# EAGLE board VMEMega (EAGLE 6.5.0), part 1 of 2
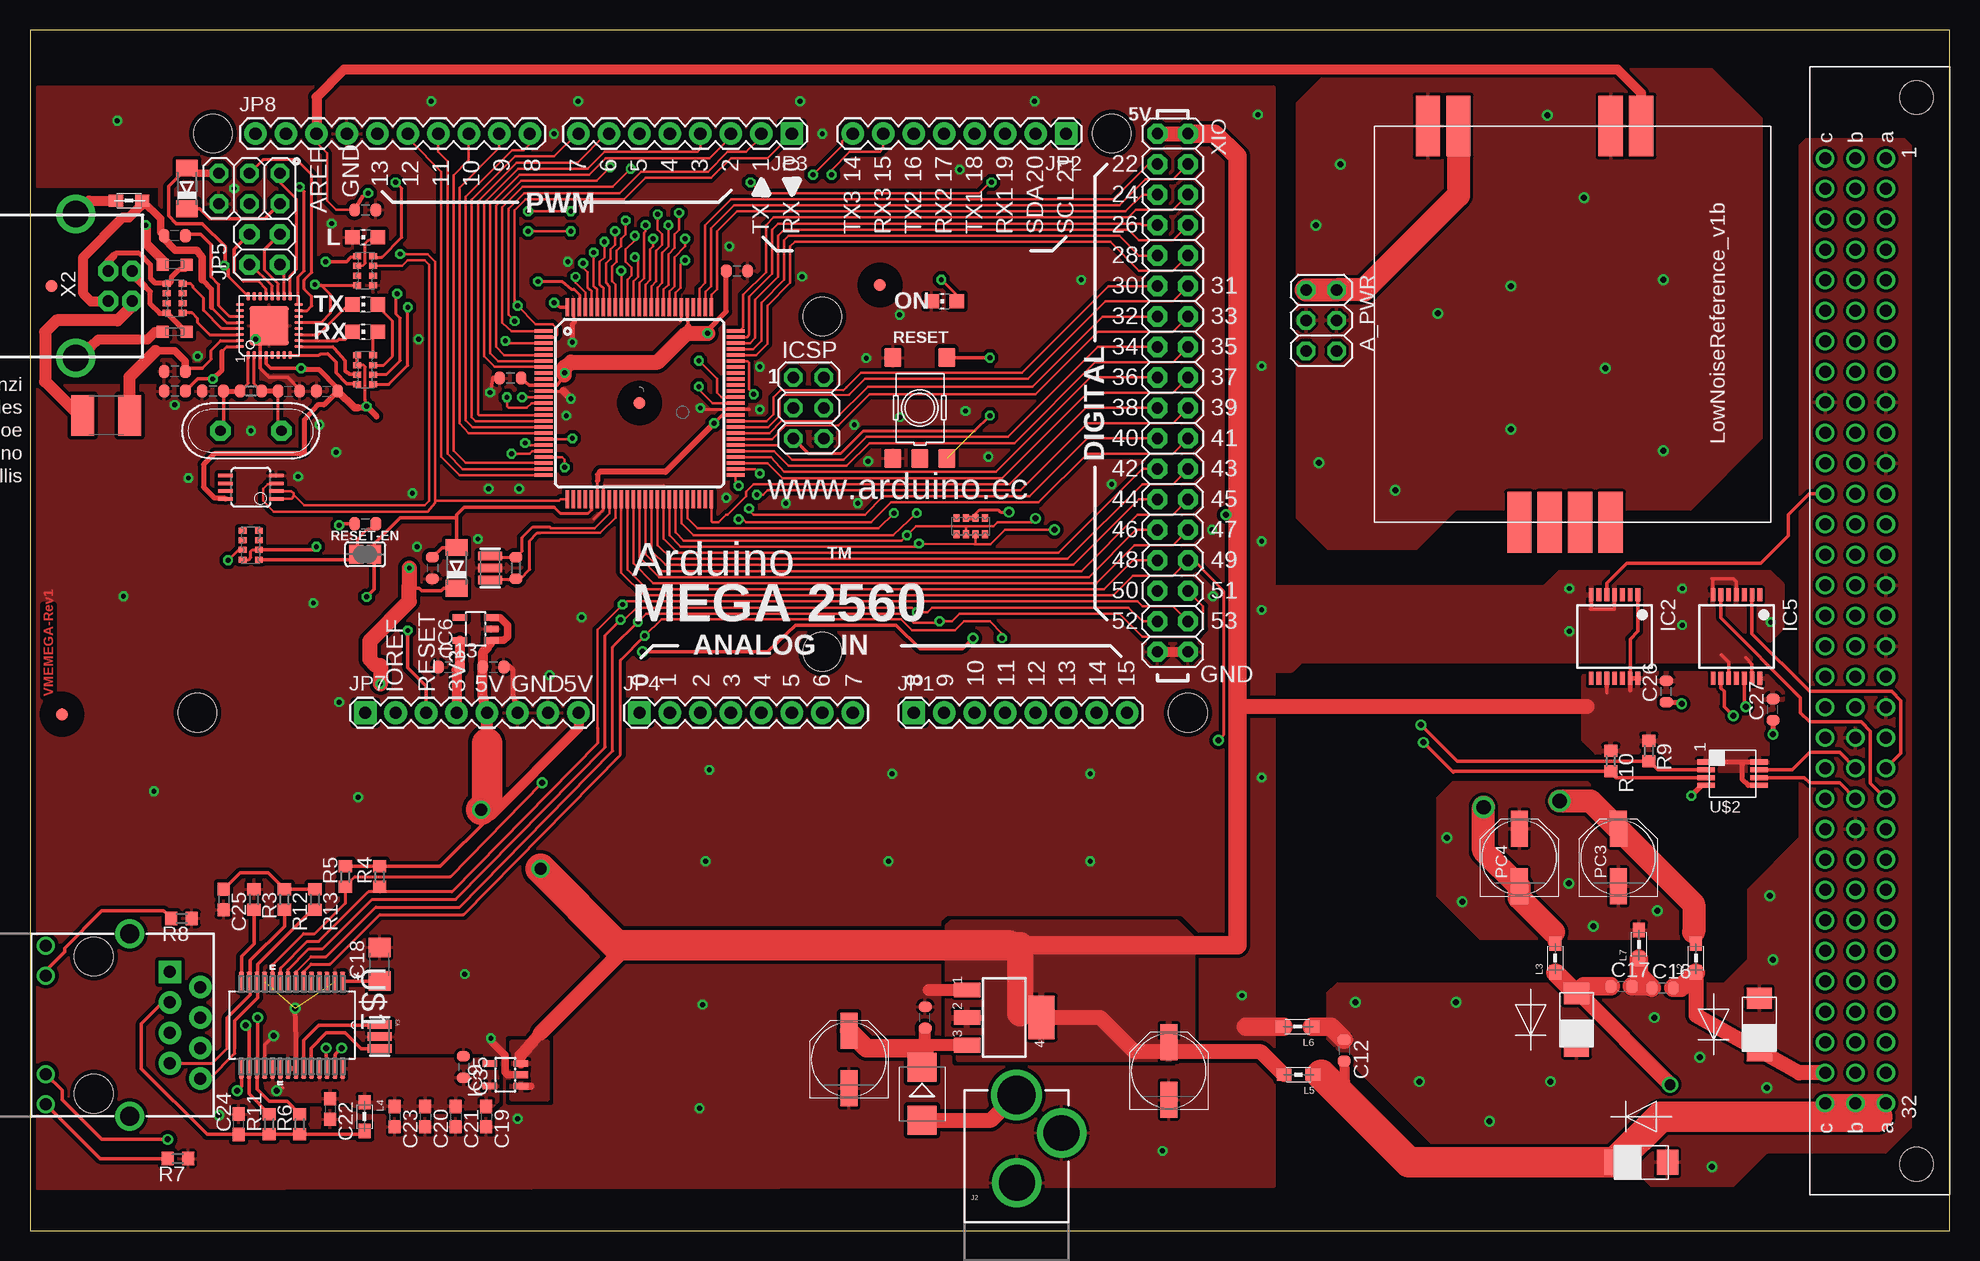
[diagram p5: board, top side]
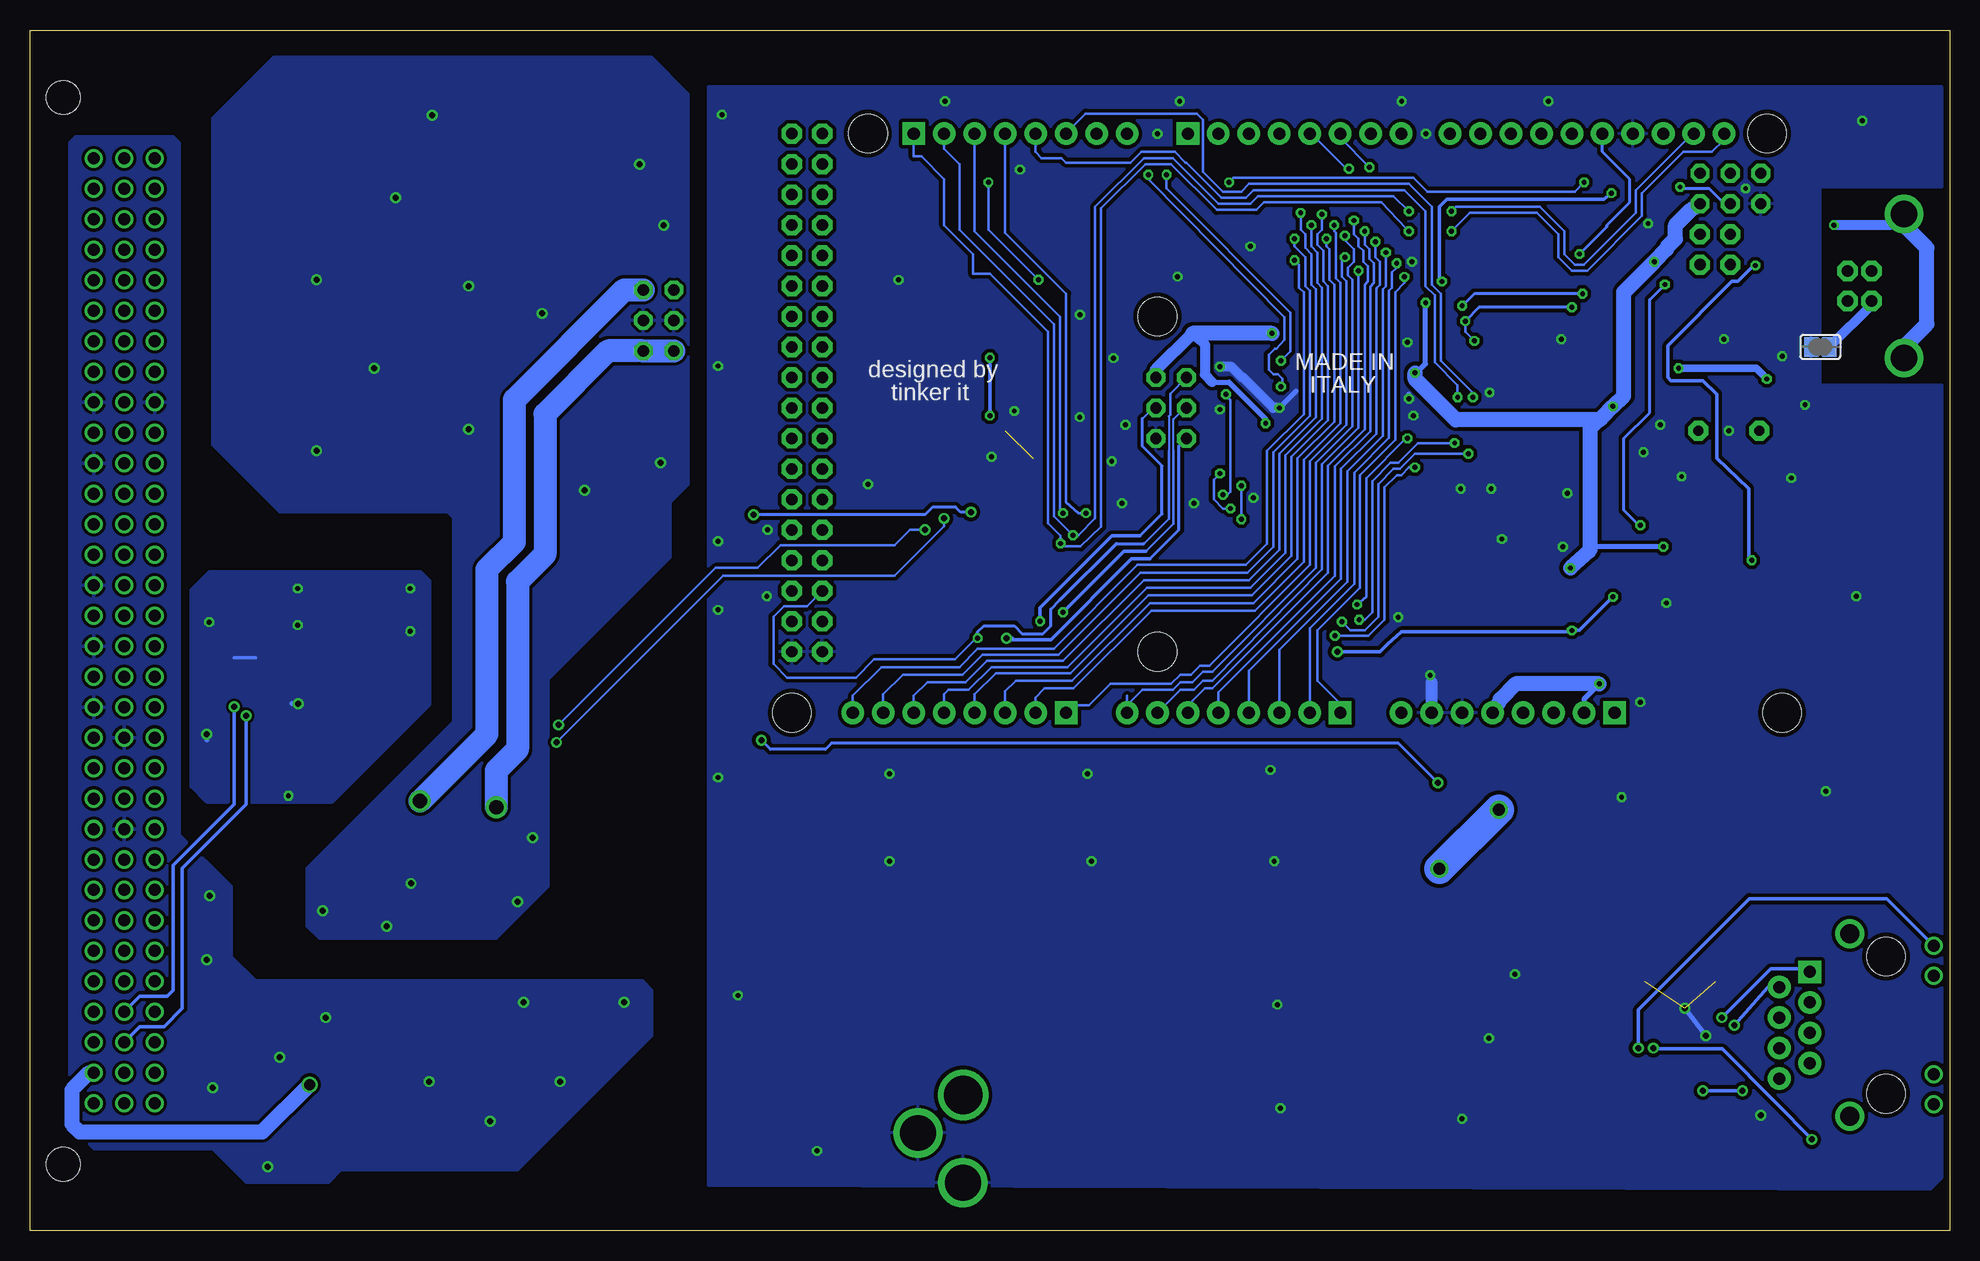
[diagram p6: board, bottom side, seen from below]

Size 160.02 x 100.08 mm. Coordinates in mm from the lower left corner, seen from the top.
Outline: 0,0 160.02,0 160.02,100.08 0,100.08 0,0
Copper layers (1*16): Top 0.035559375mm / dielectric 1.501140625mm / Bottom 0.035559375mm
Design rules "elecrow": minimum track width 8mil, minimum drill 12mil, track to track 6mil, track to pad 6mil, pad to pad 8mil, via to via 6mil, smd to smd 6mil, copper to edge 15mil, drill to drill 8mil, minimum pad ring 10mil, minimum via ring 8mil, stop-mask expansion 4mil, vias tented up to drill 20mil, thermal gap 10mil
Net classes: 0 default: width 0.203 mm, drill 0.406 mm, clearance 0.203 mm; 1 power: width 0.254 mm, drill 0.305 mm, clearance 0.203 mm; 2 gnd: width 0.254 mm, drill 0.406 mm, clearance 0.203 mm; 3 power usb: width 0.254 mm, drill 0.305 mm, clearance 0.203 mm; 4 aref: width 0.406 mm, drill 0.61 mm, clearance 0.254 mm
Holes 3.2 mm at 96.52,43.18 15.24,91.44 90.17,91.44 13.97,43.18 66.04,76.2 66.04,48.26

## Footprints (pad centres in the part's own frame; a part is rotated, then mirrored left to right if it is on the bottom)
2X03 = drill 0.95 pad 1.55 octagon: 1 -2.54,-1.27; 2 -2.54,1.27; 3 0,-1.27; 4 0,1.27; 5 2.54,-1.27; 6 2.54,1.27
C0603-ROUND = smd 0.898 x 1.1: 1 -0.889,0; 2 0.889,0
C1206 = smd 1.6 x 1.8: 1 -1.4,0; 2 1.4,0
C0603 = smd 1.1 x 1: 1 -0.85,0; 2 0.85,0
SMB = smd 2.4 x 2.4: A 2.2,0; C -2.2,0
MINIMELF = smd 1.4 x 1.8: A 1.7,0; C -1.7,0
L1812 = smd 1.9 x 3.4: 1 -1.95,0; 2 1.95,0
FIDUCIA-MOUNT = smd 1.016 x 1.016: P$1 0,0
SJ = smd 1.168 x 1.6: 1 -0.762,0; 2 0.762,0
SOT223 = smd 1.219 x 2.235: 1 -2.311,-3.099; 2 0,-3.099; 3 2.311,-3.099 | smd 3.6 x 2.2: 4 0,3.099
SSOP14 = smd 0.4 x 1.1: 1 -1.95,-3.475; 2 -1.3,-3.475; 3 -0.65,-3.475; 4 0,-3.475; 5 0.65,-3.475; 6 1.3,-3.475; 7 1.95,-3.475; 8 1.95,3.475; 9 1.3,3.475; 10 0.65,3.475; 11 0,3.475; 12 -0.65,3.475; 13 -1.3,3.475; 14 -1.95,3.475
TQFP100 = smd 1.5 x 0.28: 1 -8,6; 2 -8,5.5; 3 -8,5; 4 -8,4.5; 5 -8,4; 6 -8,3.5; 7 -8,3; 8 -8,2.5; 9 -8,2; 10 -8,1.5; 11 -8,1; 12 -8,0.5; 13 -8,0; 14 -8,-0.5; 15 -8,-1; 16 -8,-1.5; 17 -8,-2; 18 -8,-2.5; 19 -8,-3; 20 -8,-3.5; 21 -8,-4; 22 -8,-4.5; 23 -8,-5; 24 -8,-5.5; 25 -8,-6; 51 8,-6; 52 8,-5.5; 53 8,-5; 54 8,-4.5; 55 8,-4; 56 8,-3.5; 57 8,-3; 58 8,-2.5; 59 8,-2; 60 8,-1.5; 61 8,-1; 62 8,-0.5; 63 8,0; 64 8,0.5; 65 8,1; 66 8,1.5; 67 8,2; 68 8,2.5; 69 8,3; 70 8,3.5; 71 8,4; 72 8,4.5; 73 8,5; 74 8,5.5; 75 8,6 | smd 0.28 x 1.5: 26 -6,-8; 27 -5.5,-8; 28 -5,-8; 29 -4.5,-8; 30 -4,-8; 31 -3.5,-8; 32 -3,-8; 33 -2.5,-8; 34 -2,-8; 35 -1.5,-8; 36 -1,-8; 37 -0.5,-8; 38 0,-8; 39 0.5,-8; 40 1,-8; 41 1.5,-8; 42 2,-8; 43 2.5,-8; 44 3,-8; 45 3.5,-8; 46 4,-8; 47 4.5,-8; 48 5,-8; 49 5.5,-8; 50 6,-8; 76 6,8; 77 5.5,8; 78 5,8; 79 4.5,8; 80 4,8; 81 3.5,8; 82 3,8; 83 2.5,8; 84 2,8; 85 1.5,8; 86 1,8; 87 0.5,8; 88 0,8; 89 -0.5,8; 90 -1,8; 91 -1.5,8; 92 -2,8; 93 -2.5,8; 94 -3,8; 95 -3.5,8; 96 -4,8; 97 -4.5,8; 98 -5,8; 99 -5.5,8; 100 -6,8
MLF32 = smd 0.7 x 0.28: 1 -2.45,1.75; 2 -2.45,1.25; 3 -2.45,0.75; 4 -2.45,0.25; 5 -2.45,-0.25; 6 -2.45,-0.75; 7 -2.45,-1.25; 8 -2.45,-1.75; 17 2.45,-1.75; 18 2.45,-1.25; 19 2.45,-0.75; 20 2.45,-0.25; 21 2.45,0.25; 22 2.45,0.75; 23 2.45,1.25; 24 2.45,1.75 | smd 0.28 x 0.7: 9 -1.75,-2.45; 10 -1.25,-2.45; 11 -0.75,-2.45; 12 -0.25,-2.45; 13 0.25,-2.45; 14 0.75,-2.45; 15 1.25,-2.45; 16 1.75,-2.45; 25 1.75,2.45; 26 1.25,2.45; 27 0.75,2.45; 28 0.25,2.45; 29 -0.25,2.45; 30 -0.75,2.45; 31 -1.25,2.45; 32 -1.75,2.45 | smd 3.254 x 3.254: 33 0,0
SOT23-DBV = smd 0.55 x 1.2: 1 -0.95,-1.3; 2 0,-1.3; 3 0.95,-1.3; 4 0.95,1.3; 5 -0.95,1.3
MSOP08 = smd 0.3 x 1.2: 1 -0.976,-2.113; 2 -0.326,-2.113; 3 0.324,-2.113; 4 0.974,-2.113; 5 0.974,2.112; 6 0.324,2.112; 7 -0.326,2.112; 8 -0.976,2.112
MAGJACK = drill 1 pad 1.88 square: 1 3.175,17.445 | drill 1 pad 1.88: 2 4.445,19.985; 3 5.715,17.445; 4 6.985,19.985; 5 8.255,17.445; 6 9.525,19.985; 7 10.795,17.445; 8 12.065,19.985 | drill 1 pad 1.27: 9 1,7.1; 10 3.5,7.1; 11 11.7,7.1; 12 14.2,7.1 | drill 1.6 pad 2.184: M1 0,14.1; M2 15.2,14.1 | hole 3.2: 1.905,11.095; 13.335,11.095
POWER_JACK_PTH_LOCK = drill 2.997 pad 4.115: GND 0.025,6.557; GNDBREAK 3.762,10.7 | drill 3.2 pad 4.115: PWR 0,13.878
1X08 = drill 1.016 pad 1.88 square: 1 0,0 | drill 1.016 pad 1.88: 2 2.54,0; 3 5.08,0; 4 7.62,0; 5 10.16,0; 6 12.7,0; 7 15.24,0; 8 17.78,0
2X02 = drill 0.95 pad 1.676 octagon: 1 -1.27,-1.27; 2 -1.27,1.27; 3 1.27,-1.27; 4 1.27,1.27
1X10 = drill 1.016 pad 1.88: 1 0,0; 2 2.54,0; 3 5.08,0; 4 7.62,0; 5 10.16,0; 6 12.7,0; 7 15.24,0; 8 17.78,0; 9 20.32,0; 10 22.86,0
CHIP-LED0805 = smd 1.2 x 1.2: A 0,-1.05; C 0,1.05
0805 = smd 1.2 x 1: 1 -1.1,0; 2 1.1,0
0805' = smd 1.2 x 1: 1 -1.2,0; 2 1.2,0
PANASONIC_D = smd 3 x 1.4: + 2.4,0; - -2.4,0
R0603-ROUND = smd 0.898 x 1.1: 1 -0.889,0; 2 0.889,0
R0603 = smd 1 x 1.1: 1 -0.85,0; 2 0.85,0
TS42 = smd 1.6 x 1.4: 1 -4.2,2.25; 2 4.2,2.25; 3 -4.2,-2.25; 4 4.2,-2.25; 5 -4.2,0
CAT16 = smd 0.5 x 0.65: 1 -1.2,-0.675; 2 -0.4,-0.675; 3 0.4,-0.675; 4 1.2,-0.675; 5 1.2,0.675; 6 0.4,0.675; 7 -0.4,0.675; 8 -1.2,0.675
CAY16 = smd 0.5 x 0.65: 1 -1.2,-0.675; 2 -0.4,-0.675; 3 0.4,-0.675; 4 1.2,-0.675; 5 1.2,0.675; 6 0.4,0.675; 7 -0.4,0.675; 8 -1.2,0.675
SOP65P780X200-28N = smd 1.651 x 0.432: 1 -3.632,4.216; 2 -3.632,3.581; 3 -3.632,2.921; 4 -3.632,2.286; 5 -3.632,1.626; 6 -3.632,0.965; 7 -3.632,0.33; 8 -3.632,-0.33; 9 -3.632,-0.965; 10 -3.632,-1.626; 11 -3.632,-2.286; 12 -3.632,-2.921; 13 -3.632,-3.581; 14 -3.632,-4.216; 15 3.632,-4.216; 16 3.632,-3.581; 17 3.632,-2.921; 18 3.632,-2.286; 19 3.632,-1.626; 20 3.632,-0.965; 21 3.632,-0.33; 22 3.632,0.33; 23 3.632,0.965; 24 3.632,1.626; 25 3.632,2.286; 26 3.632,2.921; 27 3.632,3.581; 28 3.632,4.216
TSSOP-8 = smd 0.43 x 1.45: P$1 -0.975,-2.2; P$2 -0.325,-2.2; P$3 0.325,-2.2; P$4 0.975,-2.2; P$5 0.975,2.2; P$6 0.325,2.2; P$7 -0.325,2.2; P$8 -0.975,2.2
LOWNOISE_VREF_V1B = smd 5.08 x 2.032: P$1 0,4.445; P$2 0,6.985; P$3 0,19.685; P$4 0,22.225; P$5 33.02,12.065; P$6 33.02,14.605; P$7 33.02,17.145; P$8 33.02,19.685
D0-214AC = smd 1.778 x 2.083: P$1 -2.184,0; P$2 2.184,0
DIN_41612_PLUG = drill 1: P$1A 39.37,0; P$1A1 39.37,2.54; P$1A2 39.37,5.08; P$2A 36.83,0; P$2A1 36.83,2.54; P$2A2 36.83,5.08; P$3A 34.29,0; P$3A1 34.29,2.54; P$3A2 34.29,5.08; P$4A 31.75,0; P$4A1 31.75,2.54; P$4A2 31.75,5.08; P$5A 29.21,0; P$5A1 29.21,2.54; P$5A2 29.21,5.08; P$6A 26.67,0; P$6A1 26.67,2.54; P$6A2 26.67,5.08; P$7A 24.13,0; P$7A1 24.13,2.54; P$7A2 24.13,5.08; P$8A 21.59,0; P$8A1 21.59,2.54; P$8A2 21.59,5.08; P$9A 19.05,0; P$9A1 19.05,2.54; P$9A2 19.05,5.08; P$10A 16.51,0; P$10A1 16.51,2.54; P$10A2 16.51,5.08; P$11A 13.97,0; P$11A1 13.97,2.54; P$11A2 13.97,5.08; P$12A 11.43,0; P$12A1 11.43,2.54; P$12A2 11.43,5.08; P$13A 8.89,0; P$13A1 8.89,2.54; P$13A2 8.89,5.08; P$14A 6.35,0; P$14A1 6.35,2.54; P$14A2 6.35,5.08; P$15A 3.81,0; P$15A1 3.81,2.54; P$15A2 3.81,5.08; P$16A 1.27,0; P$16A1 1.27,2.54; P$16A2 1.27,5.08; P$17A -1.27,0; P$17A1 -1.27,2.54; P$17A2 -1.27,5.08; P$18A -3.81,0; P$18A1 -3.81,2.54; P$18A2 -3.81,5.08; P$19A -6.35,0; P$19A1 -6.35,2.54; P$19A2 -6.35,5.08; P$20A -8.89,0; P$20A1 -8.89,2.54; P$20A2 -8.89,5.08; P$21A -11.43,0; P$21A1 -11.43,2.54; P$21A2 -11.43,5.08; P$22A -13.97,0; P$22A1 -13.97,2.54; P$22A2 -13.97,5.08; P$23A -16.51,0; P$23A1 -16.51,2.54; P$23A2 -16.51,5.08; P$24A -19.05,0; P$24A1 -19.05,2.54; P$24A2 -19.05,5.08; P$25A -21.59,0; P$25A1 -21.59,2.54; P$25A2 -21.59,5.08; P$26A -24.13,0; P$26A1 -24.13,2.54; P$26A2 -24.13,5.08; P$27A -26.67,0; P$27A1 -26.67,2.54; P$27A2 -26.67,5.08; P$28A -29.21,0; P$28A1 -29.21,2.54; P$28A2 -29.21,5.08; P$29A -31.75,0; P$29A1 -31.75,2.54; P$29A2 -31.75,5.08; P$30A -34.29,0; P$30A1 -34.29,2.54; P$30A2 -34.29,5.08; P$31A -36.83,0; P$31A1 -36.83,2.54; P$31A2 -36.83,5.08; P$32A -39.37,0; P$32A1 -39.37,2.54; P$32A2 -39.37,5.08 | hole 2.8: 44.45,-2.54; -44.45,-2.54
PN61729 = drill 0.95 pad 1.676 octagon: 1 1.25,4.71; 2 -1.25,4.71; 3 -1.25,2.71; 4 1.25,2.71 | drill 2.2: P$1 -6,0; P$2 6,0
2X18 = drill 0.95 pad 1.676 octagon: 1 -21.59,-1.27; 2 -21.59,1.27; 3 -19.05,-1.27; 4 -19.05,1.27; 5 -16.51,-1.27; 6 -16.51,1.27; 7 -13.97,-1.27; 8 -13.97,1.27; 9 -11.43,-1.27; 10 -11.43,1.27; 11 -8.89,-1.27; 12 -8.89,1.27; 13 -6.35,-1.27; 14 -6.35,1.27; 15 -3.81,-1.27; 16 -3.81,1.27; 17 -1.27,-1.27; 18 -1.27,1.27; 19 1.27,-1.27; 20 1.27,1.27; 21 3.81,-1.27; 22 3.81,1.27; 23 6.35,-1.27; 24 6.35,1.27; 25 8.89,-1.27; 26 8.89,1.27; 27 11.43,-1.27; 28 11.43,1.27; 29 13.97,-1.27; 30 13.97,1.27; 31 16.51,-1.27; 32 16.51,1.27; 33 19.05,-1.27; 34 19.05,1.27; 35 21.59,-1.27; 36 21.59,1.27
RESONATOR = smd 0.7 x 2: 1 -1,0; 2 0,0; 3 1,0
QS = drill 0.85 pad 1.676 octagon: 1 -2.54,0; 2 2.54,0
CT/CN0603 = smd 1 x 1: 1 -1,0; 2 1,0

## Placement (x,y rotation side)
A_PWR  3x2M  [2X03]  107.63,75.88 270 top
C1  22p  [C0603-ROUND]  33.53,55.24 270 top
C2  100n  [C0603-ROUND]  74.61,17.78 90 top
C3  100n  [C0603-ROUND]  27.94,85.09 0 top
C4  100n  [C0603-ROUND]  38.61,46.99 0 top
C5  100n  [C0603-ROUND]  58.93,80.01 0 top
C6  100n  [C0603-ROUND]  40.05,71.06 180 top
C7  100n  [C0603-ROUND]  27.94,58.93 0 top
C8  100n  [C0603-ROUND]  12.06,71.63 180 top
C9  100n  [C0603-ROUND]  12.06,69.98 180 top
C10  1u  [C0603-ROUND]  12.06,82.93 180 top
C11  100n  [C0603-ROUND]  24.77,69.98 0 top
C12  100n  [C0603-ROUND]  109.54,15.05 270 top
C13  1u  [C0603-ROUND]  34.92,46.99 0 top
C14  22p  [C0603-ROUND]  15.24,69.98 180 top
C15  22p  [C0603-ROUND]  21.59,69.98 0 top
C16  100n  [C0603-ROUND]  136.08,20.26 0 top
C17  100n  [C0603-ROUND]  132.65,20.38 0 top
C18  10u  [C1206]  29.15,22.23 90 top
C19  100n  [C0603]  38.04,9.53 270 top
C20  100n  [C0603]  32.96,9.53 270 top
C21  100n  [C0603]  35.5,9.53 270 top
C22  100n  [C0603]  25.02,10.16 270 top
C23  100n  [C0603]  30.42,9.53 270 top
C24  100p  [C0603]  17.4,8.89 90 top
C25  10n  [C0603]  16.13,27.62 270 top
C26  100n  [C0603-ROUND]  136.4,44.96 90 top
C27  100n  [C0603-ROUND]  145.29,43.43 90 top
C35  1u  [C0603-ROUND]  36.13,13.65 270 top
D1  M7  [SMB]  74.36,11.43 270 top
D2  CD1206-S01575  [MINIMELF]  13.08,86.87 90 top
D3  CD1206-S01575  [MINIMELF]  35.56,55.24 90 top
F1  MF-MSMF050-2 500mA  [L1812]  6.35,67.94 180 top
FD1  FIDUCIALMOUNT  [FIDUCIA-MOUNT]  70.84,78.83 0 top
FD2  FIDUCIALMOUNT  [FIDUCIA-MOUNT]  2.67,43.05 0 top
FD3  FIDUCIALMOUNT  [FIDUCIA-MOUNT]  1.78,78.74 0 top
FD4  FIDUCIALMOUNT  [FIDUCIA-MOUNT]  50.8,68.99 0 top
GROUND  [SJ]  10.79,73.66 180 bottom
IC1  NCP1117ST50T3G  [SOT223]  81.22,17.78 270 top
IC2  74ABT125DB  [SSOP14]  132.08,49.53 180 top
IC3  ATMEGA2560-16AU  [TQFP100]  50.8,68.99 0 top
IC4  ATMEGA16U2-MU  [MLF32]  19.94,75.44 90 top
IC5  74ABT125DB  [SSOP14]  142.24,49.53 180 top
IC6  LP2985-33DBVR  [SOT23-DBV]  37.15,50.16 90 top
IC7  LMV358IDGKR  [MSOP08]  18.41,61.98 90 top
IC9  LP2985-33DBVR  [SOT23-DBV]  39.62,13.02 90 top
ICSP  3x2M  [2X03]  64.9,68.58 270 top
ICSP1  3x2M  [2X03]  18.29,86.87 180 top
J1  MAGJACK  [MAGJACK]  -5.78,24.77 270 top
J2  POWER_JACKPTH_LOCK  [POWER_JACK_PTH_LOCK]  82.23,-2.54 0 top
JP1  [1X08]  73.66,43.18 0 top
JP2  [1X08]  86.36,91.44 180 top
JP3  [1X08]  63.5,91.44 180 top
JP4  [1X08]  50.8,43.18 0 top
JP5  2x2M - NM  [2X02]  19.56,81.79 90 top
JP7  [1X08]  27.94,43.18 0 top
JP8  M10"  [1X10]  18.8,91.44 0 top
L  YELLOW  [CHIP-LED0805]  27.94,82.8 90 top
L1  BLM21  [0805]  8.26,85.85 180 top
L2  [0805']  138.87,22.73 90 top
L3  [0805']  127.13,22.73 90 top
L4  [0805']  27.88,9.53 270 top
L5  [0805']  105.73,13.02 180 top
L6  [0805']  105.66,17.02 180 top
L7  [0805']  134.11,23.88 90 top
ON  GREEN  [CHIP-LED0805]  76.2,77.47 90 top
PC1  47u  [PANASONIC_D]  68.26,14.29 90 top
PC2  47u  [PANASONIC_D]  94.93,13.34 90 top
PC3  47u  [PANASONIC_D]  132.4,31.11 90 top
PC4  47u  [PANASONIC_D]  124.14,31.11 90 top
R1  1M  [R0603-ROUND]  40.51,55.24 90 top
R2  1M  [R0603-ROUND]  18.41,69.98 0 top
R3  2k/1%  [R0603]  18.67,27.62 270 top
R4  100k  [R0603]  29.15,29.53 90 top
R5  10k  [R0603]  26.29,29.53 90 top
R6  49.9/1%  [R0603]  22.48,8.89 90 top
R7  100  [R0603]  12.32,6.03 180 top
R8  100  [R0603]  12.64,26.04 180 top
R9  1.5k  [R0603]  134.94,40.01 270 top
R10  1.5k  [R0603]  131.76,39.16 270 top
R11  49.9/1%  [R0603]  19.94,8.89 90 top
R12  49.9/1%  [R0603]  21.21,27.62 270 top
R13  49.9/1%  [R0603]  23.75,27.62 270 top
RESET  TS42031-160R-TR-7260  [TS42]  74.17,68.58 90 top
RESET-EN  [SJ]  27.94,56.39 0 top
RN1  10K  [CAT16]  78.42,58.74 0 top
RN2  22R  [CAY16]  12.06,77.72 90 top
RN3  1k  [CAY16]  27.94,80.01 270 top
RN4  1k  [CAY16]  27.94,71.75 90 top
RN5  10K  [CAT16]  18.41,57.15 90 top
RX  YELLOW  [CHIP-LED0805]  27.94,74.93 90 top
TX  YELLOW  [CHIP-LED0805]  27.94,77.22 90 top
U$1  ENC28J60-I/SS  [SOP65P780X200-28N]  21.84,17.14 270 top
U$2  TCA9617A  [TSSOP-8]  141.92,38.1 270 top
U$3  LOWNOISE_VREF_V1B  [LOWNOISE_VREF_V1B]  112.08,92.08 270 top
U$4  SMAJ20A  [D0-214AC]  134.3,5.71 0 top
U$5  SMAJ20A  [D0-214AC]  144.15,17.21 90 top
U$6  SMAJ20A  [D0-214AC]  128.91,17.59 90 top
U$17  DIN_41612_PLUG  [DIN_41612_PLUG]  154.71,50 90 top
X2  USB-B_TH  [PN61729]  3.81,78.74 270 top
XIO  18x2F-H8.5  [2X18]  95.25,69.85 270 top
Y1  CSTCE16M0V53-R0 16MHZ  [RESONATOR]  38.35,55.24 270 top
Y2  16MHz  [QS]  18.41,66.67 180 top
Y3  CSTCW25M0X53-R0 25MHZ  [RESONATOR]  29.15,16.19 270 top
Z1  CG0603MLC-05E  [CT/CN0603]  12.06,74.93 0 top
Z2  CG0603MLC-05E  [CT/CN0603]  12.06,80.52 0 top

## Tracks (layer width: path | path; a pad name or v marks a point on that pad's centre or on a via)
8PB4
  Top 0.254: 20.57,80.52 JP5.1 21.19,80.16 IC4.18
8PB5
  Top 0.254: 19.56,81.79 19.56,80.06 20.69,78.93 IC4.19
  Top 0.305: 19.56,81.79 JP5.3
8PB6
  Top 0.254: IC4.20 20.19,78.74 18.41,80.52 JP5.2
8PB7
  Top 0.254: IC4.21 19.68,78.49 19.05,79.12 17.78,79.12 17.02,79.88 17.02,80.01
  Top 0.305: 17.02,80.01 17.02,81.79 JP5.4
+3V3  (via drill 0.5)
  Top 0.305: v20.57,11.68 21.08,11.94 | U$1.15 17.63,12.04 v17.27,11.68
  Bottom 0.305: v17.27,11.68 v20.57,11.68
  pour Top (isolate 0.254): 19.62,14.29 19.62,12.32 arc90 21.15,10.79 26.61,10.79 27.24,10.16 38.35,10.16 38.99,10.79 38.99,13.55 arc45 38.91,13.73 38.35,14.29
+3V3_2
  Top 0.813: JP7.4 35.56,46.74 C13.2 35.81,49.18 IC6.5
+5V  (via drill 0.41, 0.5, 1)
  Top 0.254: IC3.80 54.81,76.94 54.79,76.91 54.81,76.89 54.81,76.05 | 57.66,67.94 57.7,67.99 | v28.07,68.71 28,68.83 27.94,69.28 27.94,72.01 27.79,72.16 RN4.6 RN4.5 | RN5.8 18.23,55.95 18.41,56.13 18.41,56.64 18.52,56.75 RN5.2 | IC4.32 16.41,73.69 16,73.28 | 78.74,59.37 78.74,59.44 78.74,59.69 79.15,60.1 80.72,60.1 80.91,59.91 v81.6,59.91 | v99.69,59.69 100.33,59.69 100.65,60.01 | IC3.31 47.3,62.48
  Top 0.279: 57.7,67.99 IC3.61 | 44.17,76.99 IC3.100 | 19.69,72.26 IC4.4
  Top 0.305: 54.86,75.31 54.86,75.74 54.81,75.79 54.81,76.05 | v57.02,67.31 57.66,67.94 | 44.45,71.12 43.94,70.49 IC3.10 41.59,70.49 C6.1 | v43.69,77.34 44.17,76.99 | v24.64,80.77 26.42,80.77 26.74,81.15 RN3.1 | C9.1 13.97,70.99 v15.24,70.99 | RN5.2 23.6,56.75 v23.88,57.02 | 19.69,72.26 20.07,71.88 v22.61,71.88 | D2.C 14.15,85.17 14.99,84.33 19.56,84.33 ICSP1.2 | D3.C 34.49,53.55 34.29,53.34 32.64,53.34 32.43,53.55 31.93,53.55 31.62,53.85 | R5.2 R4.2 34.19,30.38 38.26,34.45 v37.59,35.12 38.1,34.61 38.42,34.61 | IC2.1 134.03,49.96 133.38,49.31 IC2.13 | 131.42,44.86 131.43,45.35 131.43,45.32 | 142.75,38.86 143,39.12 144.08,39.12 U$2.P$8 | RN1.6 78.76,59.41 78.74,59.44
  Top 0.356: IC2.10 131.43,45.35 | 133.38,45.04 IC2.13
  Top 0.381: IC2.14 IC2.13
  Top 0.406: 44.55,71.34 44.45,71.12 v44.58,71.5 | 47.5,63.25 47.3,63.05 47.3,62.48 | C5.1 58.04,76.61 56.52,75.06 56.49,75.03 v56.49,74.8 | 25.53,69.73 C11.2 | C11.2 25.65,70.23 24.13,71.75 22.73,71.75 v22.61,71.88 | C11.2 24.51,68.83 23.96,68.83 22.86,67.6 22.86,64.9 22.61,64.77 15.37,64.77 14.48,63.88 14.48,61.98 15.37,61.09 16.22,61.09 IC7.8 | 16,73.28 16,71.75 v15.24,70.99 | RN1.7 RN1.6 | U$2.P$5 143.22,37.12 142.75,37.59 142.75,38.86 | U$2.P$8 U$2.P$1
  Top 0.508: 47.5,63.25 52.96,63.25 v57.02,67.31 | 27.94,68.58 27.3,68.58 | v28.07,68.71 28.89,67.88
  Top 0.61: v28.07,68.71 27.94,68.58 | 54.86,75.31 54.86,74.93 54.99,74.8 | 38.1,48.58 38.45,48.92 IC6.1 39.5,49.22 39.81,49.53 39.81,50.48 39.18,51.12 IC6.3 | IC9.1 41.72,12.06 | 27.3,68.58 27.05,68.58 C11.2
  Top 0.813: JP7.5 37.72,44.58 C4.1 37.78,47.05 37.78,48.26 38.1,48.58 | JP7.8 45.72,41.91 38.42,34.61 | IC9.3 40.89,14 40.89,14.61
  Top 1.016: 38.1,40.64 JP7.5 | 40.89,14.61 42.35,16.32 42.55,16.51
  Top 1.27: XIO.1 XIO.2 | 44.55,71.34 44.55,71.98 45.09,72.39 52.32,72.39 54.74,74.8 54.99,74.8 v56.49,74.8 | v31.62,55.24 31.62,53.85 31.62,52.45 28.32,49.15 28.32,47.62 28.83,47.12 29.21,47.12 v29.21,45.59 | 42.55,16.51 49.85,23.81 50.8,23.81 | L5.2 102.62,14.92 92.08,14.92 89.22,17.78 IC1.4 | 129.79,43.69 100.9,43.69 100.65,43.43
  Top 1.524: 82.55,23.81 100.65,23.81 100.65,43.43 100.65,60.01 100.65,89.53 98.74,91.44 XIO.2
  Top 2.184: 82.55,18.1 82.55,23.81 81.55,23.81
  Top 2.54: 81.55,23.81 50.8,23.81 48.9,23.81 v42.55,30.16 | v37.59,35.12 38.1,35.62 38.1,40.64
  Bottom 0.254: v81.6,59.91 82.45,59.91 82.87,60.33 84.77,60.33 85.41,59.69 v99.69,59.69
  Bottom 0.406: v44.58,71.5 44.58,71.37 43.69,72.26 v43.69,77.34 | 61.47,70.74 60.07,70.74 57.02,67.69 v57.02,67.31 | v23.88,57.02 30.1,57.02 | JP7.2 30.48,44.32 v29.21,45.59
  Bottom 0.508: 29.97,56.77 29.97,56.9 arc-90 30.1,57.02
  Bottom 0.61: 63.12,74.8 63.14,74.78 | 23.62,81.92 23.5,81.79 | v22.61,71.88 16.13,71.88 v15.24,70.99
  Bottom 0.813: 61.47,70.74 62.1,71.37 62.1,73.91 63.14,74.78
  Bottom 1.016: 63.14,74.78 66.17,71.75 ICSP.2
  Bottom 1.27: v29.21,45.59 36.2,45.59 37.47,44.32 JP7.5 | v56.49,74.8 63.12,74.8 | ICSP1.2 20.95,85.47 21.59,85.09 22.86,83.82 22.86,82.68 23.62,81.92 23.62,81.79 v24.64,80.77 27.18,78.23 27.18,69.6 v28.07,68.71 28.96,67.82 29.22,67.59 | v31.62,55.24 30.1,56.64 29.97,56.77 29.97,66.93 29.22,67.59 | 29.22,67.59 41.17,67.59 44.58,70.99 v44.58,71.5
  Bottom 2.54: v42.55,30.16 v37.59,35.12
  pour Top: 76.83,25.72 95.57,25.72 96.84,24.45 96.84,15.56 95.57,14.29 77.47,14.29 76.52,15.24 76.52,25.4
  pour Top (isolate 0.254): 129.79,46.48 144.53,46.48 145.29,45.72 146.05,44.96 146.05,44.2 145.8,43.94 144.78,42.93 144.78,40.13 144.78,38.86 144.27,38.35 137.67,38.35 136.65,39.37 136.14,39.88 130.56,39.88 129.54,40.89 129.54,46.23
  pour Top (isolate 0): 40.18,15.75 43.12,15.75 43.12,10.99 40.18,10.99
+5V_IN
  Top 0.813: 107.63,13.02 L5.1 | C12.2 109.6,12.06 108.58,12.06
  Top 1.524: U$17.P$32A 152.24,10.63 | 152.24,10.63 U$17.P$32A1 U$17.P$32A2 | 152.24,10.63 153.99,9.53
  Top 2.54: 107.63,13.02 108.58,12.06 114.94,5.71 U$4.P$1 135.93,9.53 153.99,9.53
+12V  (via drill 1.2)
  Top 1.016: 138.68,24.89 138.88,24.7 L2.2
  Top 1.93: A_PWR.1 A_PWR.2 111.19,78.42 119.06,86.3 U$3.P$2 | 138.68,24.89 138.68,27.23 PC3.+ 130.1,35.81 v127.51,35.81
  Bottom 1.93: v127.51,35.81 121.92,41.4 121.92,55.12 119.63,57.4 119.63,69.28 110.49,78.42 A_PWR.2 110.3,78.42
+12V_IN
  Top 1.27: U$17.P$31A2 147.45,13.17 138.85,17.95 | 138.85,17.95 U$5.P$1 | L2.1 138.85,21.51 138.85,17.95
  Top 1.524: C16.2 137.6,20.26 L2.1
-12V  (via drill 1.2)
  Top 1.016: L3.2 127,24.06 127,24.89
  Top 1.93: 127,24.89 124.14,27.75 PC4.- 121.16,31.7 v121.16,35.31
  Bottom 1.93: A_PWR.5 A_PWR.6 111.82,73.34 117.09,68.07 117.09,56.39 119.38,54.1 119.38,40.13 121.16,38.35 v121.16,35.31
-12V_IN  (via drill 0.9)
  Top 1.27: v136.72,12.19 129.09,19.84 U$6.P$2
  Top 1.524: C17.1 129.51,20.38 U$6.P$2 128.89,19.77 L3.1
  Bottom 1.27: U$17.P$31A 155.1,13.17 156.53,11.75 156.53,8.89 155.89,8.26 140.65,8.26 v136.72,12.19
ADC0  (via drill 0.41)
  Top 0.203: IC3.97 46.3,78.16 45.47,78.99 v45.47,79.5
  Bottom 0.203: JP4.1 50.8,43.94 52.7,45.85 52.7,50.04 49.15,53.59 49.15,62.99 46.23,65.91 46.23,78.23 45.47,78.99 v45.47,79.5
ADC1  (via drill 0.41)
  Top 0.203: IC3.96 46.8,78.3 46.48,78.61 46.48,79.88 46.1,80.26 v46.1,80.64
  Bottom 0.203: JP4.2 53.34,50.24 49.63,53.95 49.63,63.2 46.74,66.09 46.74,78.36 46.48,78.61 46.48,79.88 46.1,80.26 v46.1,80.64
ADC2  (via drill 0.41)
  Top 0.203: v46.99,81.53 46.99,78.74 47.27,78.46 47.27,77.42 47.27,77.32 47.27,77.05 47.3,77.02 47.27,76.99 IC3.95
  Bottom 0.203: JP4.3 55.88,48.44 50.22,54.1 50.22,63.32 47.27,66.27 47.27,78.46 46.99,78.74 v46.99,81.53
ADC3  (via drill 0.41)
  Top 0.203: IC3.94 47.8,78.56 47.5,78.87 47.5,80.77 47.88,81.15 v47.88,82.42
  Bottom 0.203: JP4.4 58.42,43.38 58.52,43.48 58.52,43.69 58.42,43.79 58.42,46.66 50.75,54.33 50.75,63.5 47.8,66.45 47.8,78.49 47.75,78.61 47.5,78.87 47.5,80.77 47.88,81.15 v47.88,82.42
ADC4  (via drill 0.41)
  Top 0.203: IC3.93 48.3,78.7 48.01,78.99 48.01,80.64 48.39,81.03 48.39,81.79 48.77,82.17 v48.77,83.31
  Bottom 0.203: 60.96,43.08 JP4.5 60.96,44.91 51.26,54.61 51.26,63.7 48.31,66.65 48.31,78.69 48.01,78.99 48.01,80.64 48.39,81.03 48.39,81.79 48.77,82.17 v48.77,83.31
ADC5  (via drill 0.41)
  Top 0.203: IC3.92 48.8,78.83 48.51,79.12 48.51,80.39 48.9,80.77 48.9,81.66 49.28,82.04 49.28,82.68 49.66,83.06 v49.66,84.2
  Bottom 0.203: v49.66,84.2 49.66,83.06 49.28,82.68 49.28,82.04 48.9,81.66 48.9,80.77 48.51,80.39 48.51,79.12 48.77,78.87 48.77,66.8 51.82,63.75 51.82,54.86 61.47,45.21 62.1,45.21 63.5,43.81 JP4.6
ADC6  (via drill 0.41)
  Top 0.203: IC3.91 49.3,79.99 v49.28,80.01
  Bottom 0.203: v49.28,80.01 49.28,66.93 52.32,63.88 52.32,55.12 61.47,45.85 62.23,45.85 62.99,45.09 64.14,45.09 JP4.7
ADC7  (via drill 0.41)
  Top 0.203: IC3.90 49.8,79.26 50.16,79.63 50.16,80.26 49.66,80.77 49.66,81.79 50.42,82.55 v50.42,82.93
  Bottom 0.203: v50.42,82.93 50.42,82.55 49.66,81.79 49.66,80.77 50.16,80.26 50.16,79.63 49.78,79.25 49.78,67.06 52.83,64.01 52.83,55.24 61.47,46.61 62.23,46.61 63.12,45.72 64.14,45.72 64.77,45.09 67.31,45.09 68.58,43.81 | 68.58,43.81 JP4.8 | 68.58,43.81 68.58,44.58
ADC8  (via drill 0.41)
  Top 0.203: IC3.89 50.3,79.13 50.67,79.5 50.67,80.9 v50.42,81.15
  Bottom 0.203: v50.42,81.15 50.67,80.9 50.67,79.5 50.29,79.12 50.29,67.18 53.34,64.14 53.34,55.5 61.72,47.12 62.48,47.12 63.25,46.35 64.14,46.35 64.9,45.59 69.98,45.59 71.75,43.81 73.66,43.81 JP1.1
ADC9  (via drill 0.41)
  Top 0.203: IC3.88 50.8,78.99 51.18,79.38 51.18,83.19 51.31,83.31 v51.31,83.82
  Bottom 0.203: v51.31,83.82 51.31,83.31 51.18,83.19 51.18,79.38 50.8,78.99 50.8,67.31 53.85,64.26 53.85,55.75 57.91,51.69 66.55,51.69 73.03,45.21 75.44,45.21 76.2,44.45 JP1.2
ADC10  (via drill 0.41)
  Top 0.203: IC3.87 51.3,78.86 51.69,79.25 51.69,81.79 51.94,82.04 v51.94,82.68
  Bottom 0.203: v51.94,82.68 51.94,82.04 51.69,81.79 51.69,79.25 51.31,78.87 51.31,67.44 54.36,64.39 54.36,56.01 58.04,52.32 66.67,52.32 73.15,45.85 77.85,45.85 78.74,44.96 JP1.3
ADC11  (via drill 0.41)
  Top 0.203: IC3.86 51.8,78.72 52.2,79.12 52.2,81.66 52.7,82.17 52.7,83.06 52.32,83.44 v52.32,84.71
  Bottom 0.203: v52.32,84.71 52.32,83.44 52.7,83.06 52.7,82.17 52.2,81.66 52.2,79.12 51.82,78.74 51.82,67.56 54.86,64.52 54.86,56.26 58.17,52.96 66.8,52.96 73.28,46.48 79.5,46.48 81.28,44.7 JP1.4
ADC12  (via drill 0.41)
  Top 0.203: IC3.85 52.3,78.59 52.7,78.99 52.7,81.53 53.21,82.04 v53.21,83.82
  Bottom 0.203: v53.21,83.82 53.21,82.04 52.7,81.53 52.7,78.99 52.32,78.61 52.32,67.69 55.37,64.64 55.37,56.52 58.29,53.59 66.93,53.59 73.53,46.99 79.88,46.99 81.79,45.09 83.44,45.09 83.82,44.7 JP1.5
ADC13  (via drill 0.41)
  Top 0.203: IC3.84 52.8,78.45 53.21,78.87 53.21,81.41 53.72,81.92 53.72,83.06 54.1,83.44 v54.1,84.84
  Bottom 0.203: v54.1,84.84 54.1,83.44 53.72,83.06 53.72,81.92 53.21,81.41 53.21,78.87 52.83,78.49 52.83,67.82 55.88,64.77 55.88,56.77 58.42,54.23 67.18,54.23 73.91,47.5 80.26,47.5 82.04,45.72 85.22,45.72 86.36,44.58 JP1.6
ADC14  (via drill 0.41)
  Top 0.203: IC3.83 53.3,78.32 53.72,78.74 53.72,81.15 54.61,82.04 v54.61,82.68
  Bottom 0.203: v54.61,82.68 54.61,82.04 53.72,81.15 53.72,78.74 53.34,78.36 53.34,67.94 56.39,64.9 56.39,57.02 58.55,54.86 67.44,54.86 74.3,48.01 80.64,48.01 82.3,46.35 87.25,46.35 88.9,44.7 JP1.7
ADC15  (via drill 0.41)
  Top 0.203: IC3.82 53.8,78.18 54.23,78.61 54.23,80.52 v54.61,80.9
  Bottom 0.203: v54.61,80.9 54.23,80.52 54.23,78.61 53.85,78.23 53.85,68.07 56.9,65.02 56.9,57.28 58.67,55.5 67.69,55.5 74.68,48.51 81.03,48.51 82.55,46.99 89.03,46.99 91.44,44.58 JP1.8
AGND  (via drill 0.5)
  other vias: 113.79,61.72 117.35,76.45 123.44,66.8 131.32,71.88 123.44,78.74 129.54,86.11 136.14,79.25 136.14,65.02 109.22,88.9 107.19,83.82 126.49,92.96 107.44,64.01 118.11,32.77 119.38,27.43 130.3,25.4 128.27,28.96 135.64,26.67
  pour Top (isolate 0.254): 120.9,24.38 137.92,24.38 139.7,26.16 139.7,27.43 129.79,37.34 118.62,37.34 117.35,36.07 117.35,27.94
  pour Top (isolate 0.254): 105.66,93.98 108.46,96.77 140.21,96.77 144.27,92.71 144.27,66.04 138.43,60.2 118.87,60.2 115.57,56.9 108.2,56.9 105.66,59.44
  pour Bottom (isolate 0.254): 121.16,24.38 135.89,24.38 136.91,25.4 136.91,30.23 124.71,42.42 124.71,59.44 125.22,59.94 139.19,59.94 144.78,65.53 144.78,92.71 139.7,97.79 108.2,97.79 105.16,94.74 105.16,62.23 106.68,60.71 106.68,56.13 116.84,45.97 116.84,28.7
AREF  (via drill 0.41)
  Top 0.203: C3.1 25.53,85.09 24.77,85.85 24.77,89.79 23.88,90.68 JP8.3
  Top 0.254: IC3.98 45.8,78.03 45.34,78.49 45.09,78.49 44.32,79.12 v42.34,79.12
  Top 0.305: v28.19,86.49 27.73,86.23 C3.1
  Top 0.813: U$3.P$4 134.3,94.81 132.33,96.77 26.16,96.77 23.88,94.49 JP8.3
  Bottom 0.305: v28.19,86.49 28.83,85.98 41.91,85.98 42.55,85.34 42.55,79.3 v42.34,79.12
D+
  Top 0.406: 6.99,81.28 7.2,81.5 9.06,81.5 10.03,80.52 10.03,79.38 10.41,78.99 11.32,78.99 RN2.5 11.61,78.92 11.81,79.12 11.81,79.5 12.45,80.14 12.94,80.14 Z2.2
  Top 0.61: X2.3 6.52,80.81 6.99,81.28
D-
  Top 0.406: 9.53,78.74 9.56,78.74 10.03,78.27 10.03,77.22 10.79,76.45 11.32,76.45 RN2.8 12.73,75.18 Z1.2
  Top 0.61: X2.2 8.53,79.74 9.53,78.74
DTR  (via drill 0.41)
  Top 0.254: 24.26,78.81 23.81,78.81 v23.75,78.87 | 24.26,78.81 RN3.4 | IC4.13 24.25,75.69 25.02,76.45 25.02,78.05 24.26,78.81
  Top 0.305: C7.1 26.04,58.93 v25.78,58.8
  Bottom 0.254: v25.78,58.8 25.91,58.8 27.18,60.07 27.18,66.04 25.02,68.2 25.02,77.6 v23.75,78.87
GND  (via drill 0.41, 0.5)  (2 unrouted)
  Top 0.254: 44.35,70 44.32,69.98 44.31,69.99 IC3.11 | 56.08,68.48 59.92,68.48 | 59.92,68.48 59.94,68.45 | IC3.81 54.3,75.89 54.23,75.82 | IC3.32 47.8,62.03 47.88,62.1 52.83,62.1 | IC3.32 | IC3.32 47.8,60.12 46.99,59.31 | IC3.99 45.3,75.86 45.29,75.84 | 59.92,68.48 59.91,68.49 IC3.62
  Top 0.279: 19.19,71.87 IC4.3 | 19.19,72.97 19.19,73.97
  Top 0.305: 45.39,75.74 45.29,75.84 | 44.4,70 44.32,70 44.32,69.98 | 56.08,68.48 56.06,68.5 | 44.35,70 44.42,70 | v38.35,69.87 38.61,71.12 | v18.82,74.32 19.23,74.32 | C15.2 22.48,70.1 21.46,71.12 19.94,71.12 19.19,71.87 | IC4.33 19.94,73.97 v18.82,74.32 | v18.82,74.32 19.19,73.95 | 19.19,73.97 v18.82,74.32 | v20.32,16.26 19.56,15.49 U$1.18 | IC5.7 140.29,54.27 140.21,54.36 141.99,54.36 142.24,54.1 IC5.4 | IC2.4 132.08,51.82 130.05,51.82 130.13,51.9 IC2.7 | IC5.13 143.54,47.21 143,47.75 | 140.97,48.01 141.59,47.39 IC5.10
  Top 0.406: C4.2 39.88,47.12 40.26,46.74 40.26,44.58 JP7.6 | 56.06,68.5 56.01,68.45 v55.88,68.58 | v45.21,74.04 45.21,75.56 45.39,75.74 | C26.1 137.54,44.07 v137.67,43.94 | C27.1 v145.29,41.4 | U$2.P$4 139.34,37.12 v138.48,36.26 | U$1.21 U$1.22 22.17,15.93 v22.1,18.54
  Top 0.61: v55.88,68.58 55.88,68.45 | 44.42,70 v45.09,69.34 | IC9.2 39.83,13.02 39.62,13.23 39.62,14.63 38.57,15.68
  Top 0.813: XIO.35 XIO.36
  Top 1.016: IC1.1 78.09,20.07 74.93,20.07
  Top 1.524: L6.2 101.35,17.02
  Bottom 0.305: GROUND.2 10.16,73.66 | 143,47.75 141.22,47.75
  Bottom 0.406: v45.09,69.34 45.09,69.72 | v55.88,68.58 54.48,69.98 | v137.67,43.94 138.18,43.94 | v145.29,41.4 145.29,40.89 | v22.1,18.54 v20.32,16.26
  Bottom 0.813: v60.83,72.01 59.87,72.01 58.98,71.12 58.93,71.12 56.39,68.58 v55.88,68.58 | 93.73,48.51 XIO.35
  Bottom 1.016: JP7.7 43.18,45.72
  other vias: 69,60.64 38.23,61.85 32.38,74.3 87.63,79.25 90.17,62.23 72.49,76.35 23.62,52.32 32.26,57.02 40.77,61.85 17.02,86.87 25.53,64.9 58.29,82.04 77.5,88.44 44.83,80.77 44.7,67.94 43.31,46.31 25.78,44.07 13.21,62.74 24.13,67.18 25.15,83.95 60.83,68.45 58.04,61.09 12.06,68.83 77.98,68.33 102.66,72.07 79.88,64.52 69.85,64.14 72.52,67.82 18.41,66.67 69.71,72.74 63,60.64 102.66,57.47 66.04,91.44 43.67,91.44 13.97,72.9 64.36,79.53 68.71,67.18 37.34,57.66 31.88,61.47 22.35,62.87 45.97,51.13 102.35,93.03 102.66,37.78 88.38,38.1 71.87,38.1 56.63,38.42 56.31,30.8 71.55,30.8 88.38,30.8 102.66,51.75 98.54,58.42 98.6,52.9 56.05,18.86 55.8,10.22 94.41,6.67 36.24,21.4 27.35,36.13 10.33,36.64 7.79,52.9 7.29,92.52 33.45,94.15 45.69,94.15 64.18,94.15 83.74,94.15 101.01,19.62 128.32,53.53 137.72,53.53 137.72,50.48 128.32,49.97 145.08,50.74 15.75,9.65 38.41,16.06 40.65,9.34
  pour Top (isolate 0.305, rank 2): 0.64,95.33 103.71,95.33 103.71,3.68 0.64,3.49 0.64,70.48 10.79,70.48 10.79,87 0.64,87
  pour Bottom (isolate 0.305, rank 2): 0.64,95.33 103.5,95.33 103.5,3.81 1.59,3.49 0.64,4.45 0.64,70.48 10.79,70.48 10.79,87 0.64,87
  pour Top (isolate 0.254): 102.36,59.18 102.36,48.77 103.12,46.74 105.16,46.74 105.92,47.5 143.26,47.5 146.05,50.29 146.05,53.85 145.03,54.86 127.51,54.86 126.24,53.59 103.12,53.59
  pour Bottom: 127.51,54.86 145.03,54.86 146.56,53.34 146.56,37.08 145.29,35.81 134.87,35.81 126.75,43.94 126.75,54.1
GNDIO  (via drill 0.5)
  Top 1.524: L6.1 108.46,17.02 C12.1 | L7.1 134.11,21.34 C16.1 135.06,20.38 C17.2
  other vias: 110.49,19.05 118.87,19.05 115.82,12.45 121.67,9.14 126.75,12.45 140.21,5.33 139.19,14.48 144.78,11.94 135.38,17.78 145.29,22.61 145.03,27.94
  pour Top (isolate 0.254): 147.57,90.42 148.08,90.93 156.21,90.93 156.72,90.42 156.72,82.8 156.72,8.64 154.69,6.6 144.78,6.6 141.99,3.81 135.13,3.81 134.11,4.83 119.38,4.83 108.2,16 108.2,19.81 108.97,20.57 141.22,20.57 143.26,22.61 143.26,28.45 147.57,32.77
  pour Bottom (isolate 0.254): 147.57,90.68 148.08,91.19 156.21,91.19 156.72,90.68 156.72,8.89 154.69,6.86 144.78,6.86 141.99,4.06 135.13,4.06 134.11,5.08 119.38,5.08 108.2,16.26 108.2,20.07 108.97,20.83 141.22,20.83 143.26,22.86 143.26,28.7 147.57,33.02
IACKIN
  Top 0.305: U$17.P$21A 155.96,39.82 155.96,44.2 155.19,44.96 148.34,44.96 143.54,49.75 IC5.2
IACKOUT
  Top 0.305: U$17.P$22A 153.42,37.32 153.42,41.66 152.65,42.42 148.34,42.42 147.57,43.18 147.57,44.45 140.94,51.08 IC5.6
INT0_IN  (via drill 0.5)
  Top 0.305: IC5.9 140.94,45.24 141.22,44.96 141.22,43.69 v141.99,42.93
  Bottom 0.305: v141.99,42.93 141.99,35.56 147.32,30.23 147.32,18.54 148.84,17.02 150.86,17.02 U$17.P$30A1
INT1_IN  (via drill 0.5)
  Top 0.305: IC5.12 142.89,43.8 v143,43.69
  Bottom 0.305: v143,43.69 143,35.56 148.08,30.48 148.08,20.07 148.59,19.56 150.86,19.56 U$17.P$29A1
L13
  Top 0.203: RN3.7 31.01,80.41 31.5,80.9 32.89,80.9 33.27,80.52 33.27,60.83 32.89,60.45 22.86,60.45 21.97,61.34 | IC7.2 21.79,61.65 21.97,61.47 21.97,61.34 | IC7.1 21.8,61 21.97,61.21 21.97,61.34
LEDA  (via drill 0.5)
  Top 0.305: v11.49,7.62 5.97,7.62 2.67,10.92 2.67,11.72 J1.11 | v24.7,15.24 24.7,13.67 arc45 U$1.26
  Bottom 0.305: v11.49,7.62 14.54,10.73 18.98,15.17 24.63,15.17 v24.7,15.24
LEDB  (via drill 0.5)
  Top 0.305: U$1.27 25.43,14.59 arc-45 25.5,14.77 v25.97,15.24
  Bottom 0.305: v25.97,15.24 25.97,18.31 arc45 25.9,18.49 16.7,27.69 5.24,27.69 J1.9
M8RXD
  Top 0.254: 27.25,71.37 RN4.7 | IC4.9 25.25,73.69 25.4,73.53
  Top 0.305: 27.25,71.37 26.67,71.37 26.29,71.63 26.29,72.52 25.4,73.53
M8TXD
  Top 0.254: 24.83,73.09 24.2,73.09 24.1,72.99 IC4.8
  Top 0.305: 24.83,73.09 25.53,72.39 25.53,71.5 26.42,70.61 27.21,70.61 RN4.8
MISO2
  Top 0.254: IC4.17 21.69,79.6 22.23,80.14 22.23,85.98 20.83,87.38 ICSP1.1
MOSI2  (via drill 0.41)
  Top 0.254: v22.48,87 22.86,86.61 22.86,80.01 22.35,79.5 22.35,77.34 22.39,77.25 IC4.16
  Bottom 0.254: ICSP1.4 18.8,85.6 20.07,86.87 22.23,86.87 22.35,87 v22.48,87
N$2
  Top 0.254: RN3.2 27.76,80.46 27.94,80.64 27.94,82.3 28.19,82.55 L.A
N$3  (via drill 0.41)
  Top 0.203: 77.22,77.72 ON.A | v80.14,87.38 80.01,87.38 79.12,86.49 60.96,86.49 v60.07,87.38
  Top 0.254: v30.48,87.38 30.99,86.87 30.99,82.8 29.34,81.15 28.89,81.15 RN3.8 | 77.22,77.72 77.22,78.01 v75.96,79.26
  Bottom 0.203: v75.96,79.26 80.14,83.44 v80.14,87.38 | v30.48,87.38 31.24,86.61 43.56,86.61 44.7,87.76 59.69,87.76 v60.07,87.38
N$4
  Top 0.305: J1.12 5.85,6.03 R7.2
N$5
  Top 0.305: J1.10 1.32,21.6 arc-45 1.4,21.78 2.9,23.28 2.9,23.57 5.99,26.67 11.05,26.67 arc-45 11.23,26.6 R8.2
N$6
  Top 0.305: C25.1 17.5,29.84 19.84,29.84 R12.1 R13.1
N$7
  Top 0.305: L4.2 27.67,8.11 arc-45 27.49,8.04 R6.1 R11.1 C24.1 14.76,8.04 9.27,13.53 9.27,17.27 11.05,19.05 J1.3
N$11
  Top 0.305: U$1.14 17.63,22.87 18.67,23.91 R3.2 18.35,26.77
N$17
  Top 0.305: U$1.1 26.11,20.82 C18.1
N$54
  Top 0.254: RN4.4 28.61,74.46 RX.A
N$55
  Top 0.254: RN4.3 29.48,72.16 30.23,72.9 30.23,75.82 28.99,77.06 TX.A
OSC1
  Top 0.305: U$1.23 22.81,15.78 arc-45 22.88,15.96 23.99,17.07 arc-45 24.17,17.14 29.1,17.14 Y3.1
OSC2
  Top 0.305: U$1.24 arc-45 23.43,13.61 23.43,15.24 24.7,16.51 26.29,16.51 27.61,15.19 Y3.3
PA0
  Top 0.203: IC3.78 55.8,78.53 56.26,78.99 56.26,83.82 58.42,85.98 90.3,85.98 93.22,88.9 XIO.3
PA1
  Top 0.203: IC3.77 56.3,78.27 56.77,78.74 56.77,83.57 58.67,85.47 90.81,85.47 92.96,87.63 95.25,87.63 XIO.4
PA2
  Top 0.203: XIO.5 92.71,86.36 91.31,84.96 58.93,84.96 57.28,83.31 57.28,78.49 56.8,78.01 IC3.76
PA3
  Top 0.203: XIO.6 95.25,85.09 92.2,85.09 91.57,84.45 61.98,84.45 61.34,83.82 61.34,79.9 59.44,77.99 59.44,75.31 59.11,74.99 IC3.75
PA4
  Top 0.203: IC3.74 59.75,74.49 59.94,74.68 59.94,77.87 61.85,79.77 61.85,83.44 62.36,83.95 92.58,83.95 92.71,83.82 XIO.7
PA5
  Top 0.203: IC3.73 60.02,73.99 60.45,74.42 60.45,77.61 62.36,79.52 62.36,82.93 62.87,83.44 91.57,83.44 92.46,82.55 95.25,82.55 XIO.8
PA6
  Top 0.203: IC3.72 60.28,73.49 60.96,74.17 60.96,77.36 62.87,79.26 62.87,82.55 63.25,82.93 90.81,82.93 92.46,81.28 XIO.9
PA7
  Top 0.203: IC3.71 60.54,72.99 61.47,73.91 61.47,77.11 63.37,79.01 63.37,82.04 63.75,82.42 90.04,82.42 92.46,80.01 95.25,80.01 XIO.10
PB0  (via drill 0.41)
  Top 0.203: IC3.19 45.39,65.99 v45.21,66.04 | XIO.34 95.25,52.07 92.71,52.07 92.33,52.45 49.78,52.45 49.53,52.2 v49.4,52.2 47.31,50.1 47.31,41.91
  Top 0.254: U$1.9 20.88,21.89 23.11,24.13 24.07,24.13 28.19,28.26 29.15,28.26 | 47.31,41.91 47.31,40.64 35.18,28.26 29.15,28.26 | R4.1 29.15,28.26
  Bottom 0.203: v45.21,66.04 45.34,66.04 48.64,62.74 48.64,52.83 v49.4,52.2
PB1  (via drill 0.41)
  Top 0.203: XIO.33 92.71,50.8 91.57,51.94 75.18,51.94 74.8,51.56 v73.91,51.56 73.53,51.94 50.55,51.94 49.53,50.93 v49.23,50.93 | IC3.20 41.45,65.49 v41.27,65.66
  Top 0.254: U$1.8 21.51,21.77 23.24,23.5 24.38,23.5 28.51,27.62 35.5,27.62 47.94,40.32 47.94,49.64 v49.23,50.93
  Bottom 0.178: 64.69,65 64.69,67.64
  Bottom 0.203: v49.23,50.93 48.77,50.93 48.13,51.56 48.13,62.48 46.61,64.01 45.97,64.01 44.32,65.66 v41.27,65.66 | 64.69,67.64 63.75,68.58 | 67,56.64 64.69,58.95 64.69,65
  Bottom 0.254: 63.75,68.58 ICSP.3
  Bottom 0.305: 67,56.64 68.83,56.64 v73.91,51.56
PB2  (via drill 0.41)
  Top 0.203: XIO.32 97.79,52.07 97.79,50.16 97.16,49.53 92.71,49.53 90.81,51.44 77.47,51.44 76.83,50.8 v75.82,50.8 75.69,50.67 73.66,50.67 72.9,51.44 51.34,51.44 v50.67,50.77 | 22.17,21.6 23.43,22.86 | IC3.21 41.87,64.99 41.66,64.77 v40.13,64.77
  Top 0.254: U$1.7 22.17,21.6 | 23.43,22.86 24.7,22.86 28.83,26.99 35.81,26.99 48.58,40.01 48.58,48.67 v50.67,50.77
  Bottom 0.203: ICSP.4 66.42,68.58 67.31,67.69 | v50.67,50.77 49.95,50.04 48.77,50.04 47.62,51.18 47.62,62.23 46.35,63.5 45.85,63.5 44.58,64.77 v40.13,64.77
  Bottom 0.254: 67.31,67.69 67.31,65.41 65.66,63.75 65.66,59.74 67.49,57.91
  Bottom 0.305: 67.49,57.91 69.85,57.91 75.82,51.94 v75.82,50.8
PB3  (via drill 0.41)
  Top 0.203: IC3.22 44.35,64.49 44.58,64.26 v44.58,63.63 | v81.03,49.4 81.03,49.78 80.01,50.8 77.85,50.8 77.09,50.04 73.53,50.04 72.59,50.98 52.63,50.98 v51.24,49.59
  Top 0.254: U$1.6 22.81,21.6 23.43,22.23 25.02,22.23 29.15,26.35 36.13,26.35 49.21,39.69 49.21,47.56 v51.24,49.59
  Bottom 0.178: 65.1,67.89 65.1,65
  Bottom 0.203: v81.03,49.4 81.15,49.4 82.93,47.62 89.66,47.62 91.19,46.1 96.9,46.1 98.04,47.24 98.04,51.18 97.16,52.07 95.25,52.07 XIO.31 | v44.58,63.63 45.09,63.63 45.72,62.99 46.1,62.99 47.12,61.98 47.12,50.93 48.45,49.59 v51.24,49.59 | ICSP.1 64.97,69.77 64.97,68.02 65.1,67.89 | 67.18,57.28 65.1,59.36 65.1,65
  Bottom 0.254: v81.03,49.4 81.03,49.91 80.52,50.42 77.98,50.42 77.34,49.78 75.56,49.78 74.93,50.42 74.93,51.82 74.17,52.58 | 69.47,57.28 67.18,57.28
  Bottom 0.305: 74.17,52.58 69.47,57.28
PB4
  Top 0.203: IC3.23 42.9,63.99 42.93,64.01 36.32,64.01 35.31,65.02 35.31,87.98 36.58,89.25 JP8.8
PB5
  Top 0.203: IC3.24 36.08,63.49 34.8,64.77 34.8,89.15 34.04,89.92 JP8.7
PB6
  Top 0.203: IC3.25 42.92,62.99 42.93,62.99 35.81,62.99 34.29,64.52 34.29,88.27 31.75,90.81 JP8.6
PB7  (via drill 0.41)
  Top 0.203: 33.78,60.86 44.09,60.86 44.22,60.98 IC3.26 | 33.78,60.86 33.78,80.77 33.15,81.41 v30.86,81.41 | IC7.3 20.46,62.23 19.81,62.23 19.43,61.85 19.43,60.83 20.32,59.94 33.15,59.94 33.78,60.68 33.78,60.86
  Bottom 0.254: JP8.5 28.96,89.92 26.67,87.63 26.67,85.72 28.57,83.82 28.57,83.69 v30.86,81.41
PC0
  Top 0.203: IC3.53 61.49,63.99 62.74,62.74 81.03,62.74 88.14,69.85 95.25,69.85 XIO.18
PC1
  Top 0.203: IC3.54 61.75,64.49 62.87,63.25 80.52,63.25 88.39,71.12 XIO.17
PC2
  Top 0.203: IC3.55 62.01,64.99 63.25,63.75 68.07,63.75 69.98,65.66 82.04,65.66 88.77,72.39 95.25,72.39 XIO.16
PC3
  Top 0.203: IC3.56 62.28,65.49 63.5,64.26 67.82,64.26 69.72,66.17 81.53,66.17 89.03,73.66 XIO.15
PC4
  Top 0.178: 67.39,67.12 62.98,67.12 62.79,66.93
  Top 0.203: IC3.57 61.85,65.99 62.79,66.93 | 67.39,67.12 69.98,69.72 83.82,69.72 89.03,74.93 95.25,74.93 XIO.14
PC5
  Top 0.178: 62.66,67.5 66.98,67.5 67.14,67.67
  Top 0.203: IC3.58 61.66,66.49 62.66,67.5 | XIO.13 89.41,76.2 83.57,70.36 69.85,70.36 67.16,67.67 67.14,67.67
PC6
  Top 0.178: 68.28,69.66 62.79,69.66 62.48,69.36 62.48,69.34
  Top 0.203: IC3.59 61.52,66.99 62.48,67.94 62.48,69.34 | XIO.12 95.25,77.47 89.66,77.47 83.19,70.99 69.62,70.99 68.28,69.66
PC7
  Top 0.178: 68.07,70.31 67.81,70.04 62.56,70.04
  Top 0.203: IC3.60 61.39,67.49 61.98,68.07 61.98,69.47 62.56,70.04 | XIO.11 89.92,78.74 82.68,71.5 69.27,71.5 68.07,70.31
PD7
  Top 0.203: XIO.19 88.01,68.58 81.66,62.23 60.3,62.23 60.3,62.2 59.69,61.59 59.69,61.21 58.17,59.69 58.04,59.69 57.4,59.05 56.9,59.05 56.8,59.15 IC3.50
PE0  (via drill 0.41)
  Top 0.203: JP3.1 61.47,89.41 58.42,89.41 56.77,87.76 51.31,87.76 49.53,85.98 41.33,85.98 40.39,85.04 40.39,77.34 v40.64,77.09 42.16,75.56 43.56,75.56 43.94,75.18 43.94,74.68 43.75,74.49 IC3.2
  Top 0.254: v30.61,78.11 30.54,78.03 30.54,76.38 30.86,76.07 30.86,72.52 29.72,71.37 28.63,71.37 RN4.2
  Bottom 0.254: v30.61,78.11 39.62,78.11 v40.64,77.09
PE1  (via drill 0.41)
  Top 0.203: v40.39,75.82 39.88,76.33 39.88,85.17 41.2,86.49 49.15,86.49 50.93,88.27 56.52,88.27 58.17,89.92 59.69,89.92 60.96,91.19 JP3.2 | v39.62,74.17 39.88,73.91 39.95,73.99 IC3.3
  Top 0.254: RN4.1 29.91,70.56 31.5,72.14 v31.5,76.96
  Bottom 0.203: v40.39,75.82 40.39,74.93 v39.62,74.17
  Bottom 0.254: v31.5,76.96 39.24,76.96 v40.39,75.82
PE3  (via drill 0.41)
  Top 0.203: IC3.5 39.54,72.99 38.86,73.66 38.86,85.42 40.95,87.5 47.22,87.5 v48.36,88.65
  Bottom 0.203: 50.67,91.44 JP3.6 50.8,91.08 v48.36,88.65
PE4
  Top 0.203: IC3.6 39.02,72.49 38.35,73.15 38.35,85.55 40.82,88.01 46.59,88.01 47.98,89.41 56.64,89.41 58.42,91.19 JP3.3
PE5
  Top 0.203: IC3.7 42.78,71.99 42.55,72.01 38.73,72.01 37.85,72.9 37.85,85.67 40.69,88.52 46.48,88.52 47.88,89.92 55.63,89.92 55.88,90.17 JP3.4
PG0  (via drill 0.41)
  Top 0.203: IC3.51 58.8,62.48 v59.05,62.1 | XIO.22 95.25,64.77 88.14,64.77 84.07,60.71 71.75,60.71 70.1,59.05 59.69,59.05 59.44,59.31 v59.05,59.31
  Bottom 0.203: v59.05,59.31 v59.05,62.1
PG1  (via drill 0.41)
  Top 0.203: IC3.52 60.44,63.49 v60.83,63.12 | XIO.21 88.14,66.04 83.31,61.21 71.12,61.21 69.6,59.69 60.33,59.69 59.94,60.07 v59.94,60.2
  Bottom 0.203: v59.94,60.2 60.58,60.2 61.34,60.96 61.34,62.61 v60.83,63.12
PG2  (via drill 0.41)
  Top 0.203: IC3.70 59.8,72.49 59.92,72.36 59.92,70.13 v60.33,69.72 | v60.58,61.34 61.09,61.34 61.47,61.72 82.55,61.72 88.14,67.31 95.25,67.31 XIO.20
  Bottom 0.203: v60.58,61.34 60.2,61.34 59.94,61.59 59.94,69.22 v60.33,69.72
PG5  (via drill 0.41)
  Top 0.203: IC3.1 40.13,74.99 39.37,75.69 39.37,85.29 41.07,87 48.55,87 v50.08,88.52
  Bottom 0.203: JP3.5 53.21,91.44 50.29,88.52 v50.08,88.52
PH3
  Top 0.203: IC3.15 37.42,67.99 37.34,68.07 37.34,85.8 40.56,89.03 45.63,89.03 48.04,91.44 JP3.7
PH4
  Top 0.203: IC3.16 37.16,67.49 36.83,67.82 36.83,85.93 40.44,89.53 43.69,89.53 45.59,91.44 JP3.8
PH5
  Top 0.203: IC3.17 36.9,66.99 36.32,67.56 36.32,86.18 40.18,90.04 41.15,90.04 41.66,90.55 JP8.10
PH6
  Top 0.203: IC3.18 36.58,66.49 35.81,67.31 35.81,86.94 39.12,90.25 JP8.9
PL0  (via drill 0.5)
  Top 0.203: 49.28,60.94 49.28,54.86 51.18,52.96 90.3,52.96 91.95,54.61 95.25,54.61 XIO.30
  Top 0.254: IC3.35 49.3,60.96 49.28,60.94 | U$1.10 20.22,22.19 22.8,24.77 23.75,24.77 26.29,27.3 R5.1 27.08,29.53 35.05,29.53 v42.67,37.34 | XIO.30 97.03,55.88 99.52,53.29 99.52,41.35 v99.06,40.89
  Bottom 0.254: v42.67,37.34 45.97,40.64 93.22,40.64 93.73,40.13 98.3,40.13 v99.06,40.89
PL1
  Top 0.203: IC3.36 49.8,55.1 51.44,53.47 89.53,53.47 91.95,55.88 XIO.29
PL2
  Top 0.203: XIO.28 95.25,57.15 92.08,57.15 88.9,53.98 51.94,53.98 50.29,55.63 50.3,55.63 IC3.37
PL3
  Top 0.203: IC3.38 50.8,56.13 52.45,54.48 88.27,54.48 92.2,58.42 XIO.27
PL4
  Top 0.203: XIO.26 95.25,59.69 92.33,59.69 87.63,54.99 52.7,54.99 51.3,56.4 IC3.39
PL5
  Top 0.203: IC3.40 51.8,56.66 52.96,55.5 87,55.5 92.46,60.96 XIO.25
PL6
  Top 0.203: 52.32,60.88 52.32,57.15 53.47,56.01 86.49,56.01 92.71,62.23 95.25,62.23 XIO.24
  Top 0.254: IC3.41 52.3,60.96 52.27,60.94 52.32,60.88
PL7
  Top 0.203: IC3.42 52.8,57.69 53.98,56.52 85.72,56.52 92.71,63.5 XIO.23
PWRIN
  Top 1.27: D1.A 80.12,9.23 J2.PWR
RD+
  Top 0.254: RN2.4 13.4,78.92 13.59,78.74 13.59,78.61 14.48,77.72 14.48,76.71 16,75.19 IC4.29
RD-
  Top 0.254: RN2.1 13.28,76.49 13.5,76.49 13.97,76.02 13.97,75.69 14.97,74.69 IC4.30
RESET  (via drill 0.41, 0.5)  (1 unrouted)
  Top 0.254: 46.8,60.08 46.53,59.82 44.2,59.82 43.69,60.33 | 64.85,64.82 67.61,64.82 69.47,66.67 78.74,66.67 v80.01,67.94 | 28.79,58.51 28.16,58.51 27.3,57.66 27.3,56.52 RESET-EN.1
  Top 0.305: 46.8,60.08 IC3.30 | ICSP.5 64.85,64.82 | 43.69,60.33 36.2,60.33 35.56,59.69 35.56,59.44 | RESET.4 v80.01,72.77 | 28.79,58.51 C7.2 | RESET-EN.1 RESET-EN.2 | RESET-EN.1 27.3,56.01 | 35.56,59.44 D3.A 34.34,56.95 C1.1 | RESET-EN.2 28.7,57.28 30.86,59.44 35.56,59.44 | RN5.1 26.74,55.95 RESET-EN.1 | RESET-EN.2 28.7,53.47 v28.07,52.83 | JP7.3 33.02,45.4 31.5,46.93 v31.5,50.04 | v51.05,48.26 61.47,48.26 63.82,50.48 72.21,50.48 74.17,48.51 77.72,48.51 v78.61,49.4
  Bottom 0.254: 63.75,65.91 64.26,65.41 64.26,58.42 66.67,56.01
  Bottom 0.305: 77.98,49.28 74.93,49.28 68.2,56.01 66.67,56.01 | 77.98,49.28 78.11,49.4 v78.61,49.4 78.49,49.28 77.98,49.28 | 63.75,65.91 ICSP.5 | v28.07,52.83 30.86,50.04 v31.5,50.04 31.62,49.91 45.72,49.91 46.85,48.9 47.5,48.26 v51.05,48.26 | v80.01,67.94 v80.01,72.77
RESET2  (via drill 0.41)
  Top 0.254: IC4.24 16.51,79.57 16.51,79.76 | RN5.7 17.38,56.75 v16.51,55.88
  Top 0.305: ICSP1.5 14.99,88.14 | v16.51,55.88 16.58,55.95 | 16.51,79.76 16.51,80.14 v16.19,80.45 16.26,80.39 16.26,82.04 14.35,83.95 12.19,83.95 11.56,84.58 11.56,87.04 D2.A
  Top 0.61: D2.A 13.64,88.14 ICSP1.5
  Bottom 0.305: v16.51,55.88 16.76,55.88 16.76,61.85 19.43,64.39 19.43,69.72 20.57,70.87 23.24,70.87 23.5,71.12 23.5,73.77 18.15,79.12 17.65,79.12 16.45,80.33 v16.19,80.45
RXD1  (via drill 0.41)
  Top 0.203: 54.33,60.99 IC3.45 54.3,58.98 55.3,57.99 71.96,57.99 v73.91,59.82
  Bottom 0.203: JP2.3 81.28,83.31 74.17,76.2 74.17,60.2 v73.91,59.82
RXD2  (via drill 0.41)
  Top 0.203: IC3.12 41.04,69.49 v41.02,69.47
  Bottom 0.203: v41.02,69.47 41.02,70.48 42.93,72.39 42.93,77.98 43.69,78.74 43.69,84.96 45.47,86.74 58.04,86.74 58.67,86.11 60.71,86.11 63.63,89.03 63.7,89.03 64.59,89.92 67.39,89.92 68.28,89.03 73.66,89.03 74.04,89.41 75.69,89.41 76.2,89.92 JP2.5
RXD3  (via drill 0.41)
  Top 0.203: JP2.7 71.12,90.17 70.87,89.92 68.33,89.92 66.8,88.39 v66.8,88.01 | v55.75,70.36 55.75,70.1 56.9,68.96 58.8,68.96 IC3.63
  Bottom 0.203: v66.8,88.01 66.8,87.63 55.45,76.15 55.45,74.24 56.13,73.53 56.26,73.53 56.77,73.03 56.77,71.75 56.39,71.37 56.01,71.37 55.63,70.99 55.63,70.48 v55.75,70.36
RXL
  Top 0.254: 26.27,74.31 25.76,74.31 25.63,74.19 IC4.10
  Top 0.305: 26.27,74.31 RX.C
SCK2
  Top 0.254: ICSP1.3 19.43,89.28 22.23,89.28 23.5,88.01 23.5,79.88 22.86,79.25 22.86,78.49 23.5,77.85 23.5,77.09 23.09,76.69 IC4.15
SCL  (via drill 0.41, 0.5)
  Top 0.203: IC3.43 53.3,57.95 54.23,57.02 73.85,57.02 v74.11,57.28 78.74,57.21 | v41.53,83.31 v45.09,83.31 | 78.74,57.21 80.07,57.21 81.28,58.42 v85.41,58.42 | RN1.3 78.82,57.3 78.74,57.21
  Top 0.279: 118.96,39.16 R9.2
  Top 0.305: v115.95,42.16 118.96,39.16 | R9.2 135.67,38.42 U$2.P$2
  Bottom 0.203: JP2.1 86.36,89.53 85.72,89.53 83.82,87.63 83.82,83.82 81.41,81.41 81.41,79.76 80.01,79.76 75.18,74.93 75.18,58.99 74.12,57.92 v74.12,57.28 v74.11,57.28 73.86,57.04 72.45,57.04 70.74,58.67 70.74,85.22 67.06,88.9 64.9,88.9 61.09,85.09 57.78,85.09 57.15,85.72 47.37,85.72 45.34,83.57 v45.09,83.31 | JP8.1 18.8,90.93 19.81,89.92 22.23,89.92 25.65,86.49 25.65,84.58 30.23,80.01 31.5,80.01 32.64,81.15 32.64,83.06 34.42,84.84 40.01,84.84 v41.53,83.31 | v85.41,58.42 86.68,58.42 87.95,57.15 97.47,57.15 99.38,55.24 102.87,55.24 v115.95,42.16
SDA  (via drill 0.41, 0.5)
  Top 0.203: v41.53,84.96 v45.09,84.96 | 78.11,58.74 80.33,58.74 80.64,59.05 83.5,59.05 v83.82,59.37 | 78.11,58.74 73.85,58.74 v73.09,57.98 72.64,57.53 54.48,57.53 53.8,58.21 IC3.44 | RN1.2 78.02,58.66 78.11,58.74
  Top 0.305: U$2.P$3 132.19,37.77 131.76,38.2 R10.2 118.75,38.3 118.64,38.2 v116.14,40.7
  Bottom 0.203: JP2.2 83.82,90.17 82.55,88.9 82.55,83.44 74.68,75.56 74.68,59.56 v73.09,57.98 72.64,57.98 71.25,59.37 71.25,85.34 67.18,89.41 64.77,89.41 60.96,85.6 58.29,85.6 57.66,86.23 46.35,86.23 v45.09,84.96 | JP8.2 21.46,91.44 26.16,86.74 26.16,84.84 30.48,80.52 31.24,80.52 32.13,81.41 32.13,83.31 34.16,85.34 41.15,85.34 v41.53,84.96 | v83.82,59.37 83.82,58.74 87.95,54.61 102.23,54.61 v116.14,40.7
SERCLK
  Top 0.305: U$17.P$21A1 150.86,39.88 148.34,39.88 146.88,38.42 U$2.P$7
SERDAT
  Top 0.305: U$17.P$22A1 150.86,37.34 148.34,37.34 147.9,37.77 U$2.P$6
SYSRESET
  Top 0.305: IC2.5 131.43,53.96 133.1,55.63 144.27,55.63 146.56,57.91 146.56,59.69 148.3,61.43 U$17.P$12A2
TPIN+
  Top 0.254: J1.7 15.18,13.97 16.45,15.24
  Top 0.305: 16.45,15.24 16.45,17.78 18.35,19.68 18.35,20.69 | 18.35,20.69 U$1.13 | 18.35,20.69 18.35,22.54 21.21,25.4 R12.2
TPIN-
  Top 0.254: 14.54,12.7 14.99,12.7 17.08,14.8 17.08,15.24
  Top 0.305: J1.8 14.54,12.7 | 17.08,15.24 17.08,17.53 18.99,19.43 18.99,20.71 | 18.99,20.71 U$1.12 | 18.99,20.71 18.99,22.23 23.53,26.77 R13.2
TPOUT+  (via drill 0.5)
  Top 0.305: v18.99,17.78 18.99,13.58 U$1.17 18.92,11.81 19.94,10.79 21.42,10.79 R6.2
  Bottom 0.305: v18.99,17.78 14.92,21.84 12.14,21.84 11.89,21.59 J1.1
TPOUT-  (via drill 0.5)
  Top 0.305: v17.97,17.14 18.26,16.85 U$1.16 18.26,11.42 R11.2
  Bottom 0.305: J1.2 15.18,20.32 v17.97,17.14
TXD1  (via drill 0.41)
  Top 0.203: 54.8,60.9 IC3.46 54.8,59.37 55.63,58.55 70.74,58.55 v72.01,59.82
  Bottom 0.203: JP2.4 78.74,83.19 73.66,78.11 73.66,60.71 72.64,59.82 v72.01,59.82
TXD2  (via drill 0.41)
  Top 0.203: IC3.13 41.81,68.99 41.4,68.58 39.88,68.58 39.75,68.71 v39.75,69.47
  Bottom 0.203: v39.75,69.47 39.75,69.85 42.42,72.52 42.42,78.11 43.18,78.87 43.18,85.34 45.09,87.25 58.42,87.25 59.05,86.61 60.58,86.61 62.23,88.27 62.23,92.61 62.74,93.12 72.03,93.12 73.66,91.49 JP2.6
TXD3  (via drill 0.41)
  Top 0.203: JP2.8 68.33,91.44 67.69,90.81 67.69,90.42 v65.28,88.01 | IC3.64 58.66,69.49 58.55,69.47 57.66,69.47 57.28,69.85 57.28,70.99 v55.75,72.52
  Bottom 0.203: v65.28,88.01 65.28,86.87 54.97,76.53 54.97,73.3 v55.75,72.52
TXL
  Top 0.254: TX.C 26.8,77.47 24.02,74.69 IC4.11
UGND
  Top 0.254: IC4.28 16.39,75.69 15.11,76.96
  Top 0.406: 15.11,76.96 15.11,78.49 14.35,79.25
  Top 0.61: L1.1 10.88,84.33 10.88,83.23 C10.2 11.09,82.77 12.12,81.71 13.89,81.71 14.35,81.15 14.35,79.25
  Top 0.813: X2.4 6.5,77.47 5.08,77.47 4.45,78.11 4.45,81.15 7.75,84.45 8.26,84.45 9.27,85.47 9.27,85.77 L1.1
  Bottom 0.813: X2.4 6.52,77.17 GROUND.1
USBVCC
  Top 0.254: IC4.31 15.89,74.19 15.11,73.41 15.11,72.64 14.35,71.88
  Top 0.305: 14.35,71.88 13.21,71.88 C8.1
  Top 0.61: 10.48,73.34 12.06,73.34 12.95,72.45 C8.1
  Top 1.016: F1.1 8.3,71.17 10.48,73.34
USHIELD  (via drill 0.41)
  Top 0.813: X2.P$2 3.81,73.66 5.08,73.66 5.71,74.3 9.79,74.3 10.43,74.93 Z1.1 | Z2.1 11.06,80.88 9.65,82.3 v9.65,83.82 | L1.2 4.92,85.85 X2.P$1
  Bottom 0.813: v9.65,83.82 4.98,83.82 X2.P$1
  Bottom 1.27: X2.P$2 3.81,73.66 1.91,75.56 1.91,81.92 3.81,83.82 X2.P$1
VIN
  Top 0.61: 74.61,15.47 74.61,15.56 | D1.C 74.61,13.63
  Top 1.016: IC1.3 74.61,15.47 74.61,15.24 74.61,13.63 | 74.61,15.56 C2.1
  Top 1.524: PC1.+ 69.71,15.24 74.61,15.24
VUCAP
  Top 0.254: 15.11,79.5 15.75,78.87 15.75,77.09 16.65,76.19 IC4.27
  Top 0.305: C10.1 13.17,83.06 14.22,83.06 15.11,82.17 15.11,79.5
XT1
  Top 0.254: 17.8,69.98 R2.1 18.19,70.64 IC4.1
  Top 0.305: C14.1 16.13,66.93 Y2.2
  Top 0.406: C14.1 R2.1
XT2
  Top 0.254: IC4.2 18.69,70.59 R2.2 | C15.1 20.7,66.93 Y2.1
  Top 0.406: C15.1 R2.2
XTAL1
  Top 0.203: IC3.34 48.8,59.44 47.53,58.17 42.55,58.17
  Top 0.254: Y1.3 39.89,54.24 R1.1 40.89,54.36 41.66,55.12 41.66,57.53 42.29,58.17 42.55,58.17
XTAL2
  Top 0.203: 43.31,58.67 43.41,58.57 47.05,58.57 48.3,59.82 IC3.33
  Top 0.254: 37.83,56.24 Y1.1 37.96,56.24 38.07,56.13 R1.2 41.02,56.64 41.02,57.78 41.91,58.67 43.31,58.67
XVCC
  Top 1.016: X2.1 8.52,77.1 7.3,75.88 2.22,75.88 1.27,74.93 1.27,70.8 4.13,67.94 F1.2